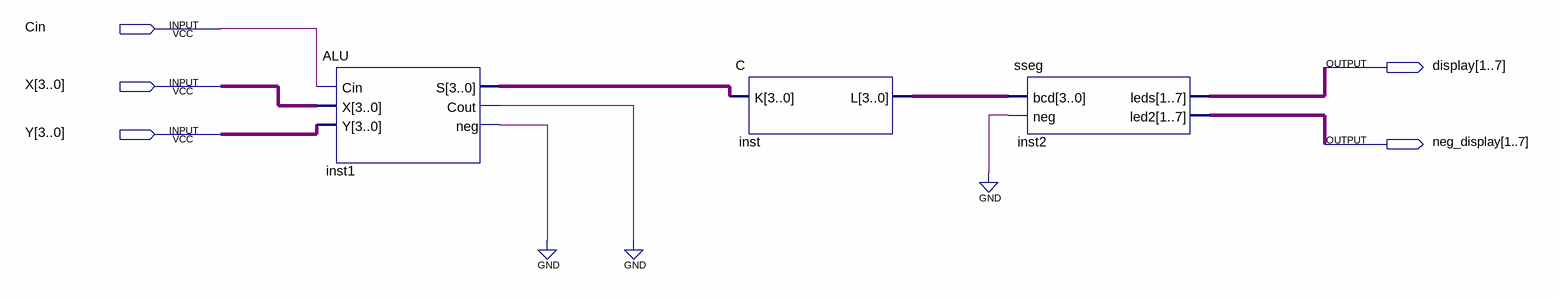
[diagram p0: schematic sheet]
// Quartus schematic CombinedASU2.bdf as structural Verilog: 3 symbols, 5 pins
module CombinedASU2 (
  input  Cin,
  input  [3:0] X,
  input  [3:0] Y,
  output [1:7] display,
  output [1:7] neg_display
);

  wire inst1_cout, inst1_neg;
  wire [3:0] inst1_s, inst_l;

  ALU inst1 (.Cin(Cin), .X(X), .Y(Y), .S(inst1_s), .Cout(inst1_cout), .neg(inst1_neg));
  C inst (.K(inst1_s), .L(inst_l));
  sseg inst2 (.bcd(inst_l), .neg(1'b0), .leds(display), .led2(neg_display));
  // also tied to GND on the sheet: {inst1_neg, inst1_cout}
endmodule
